# EAGLE design bulb-2 (EAGLE 6.5.0)
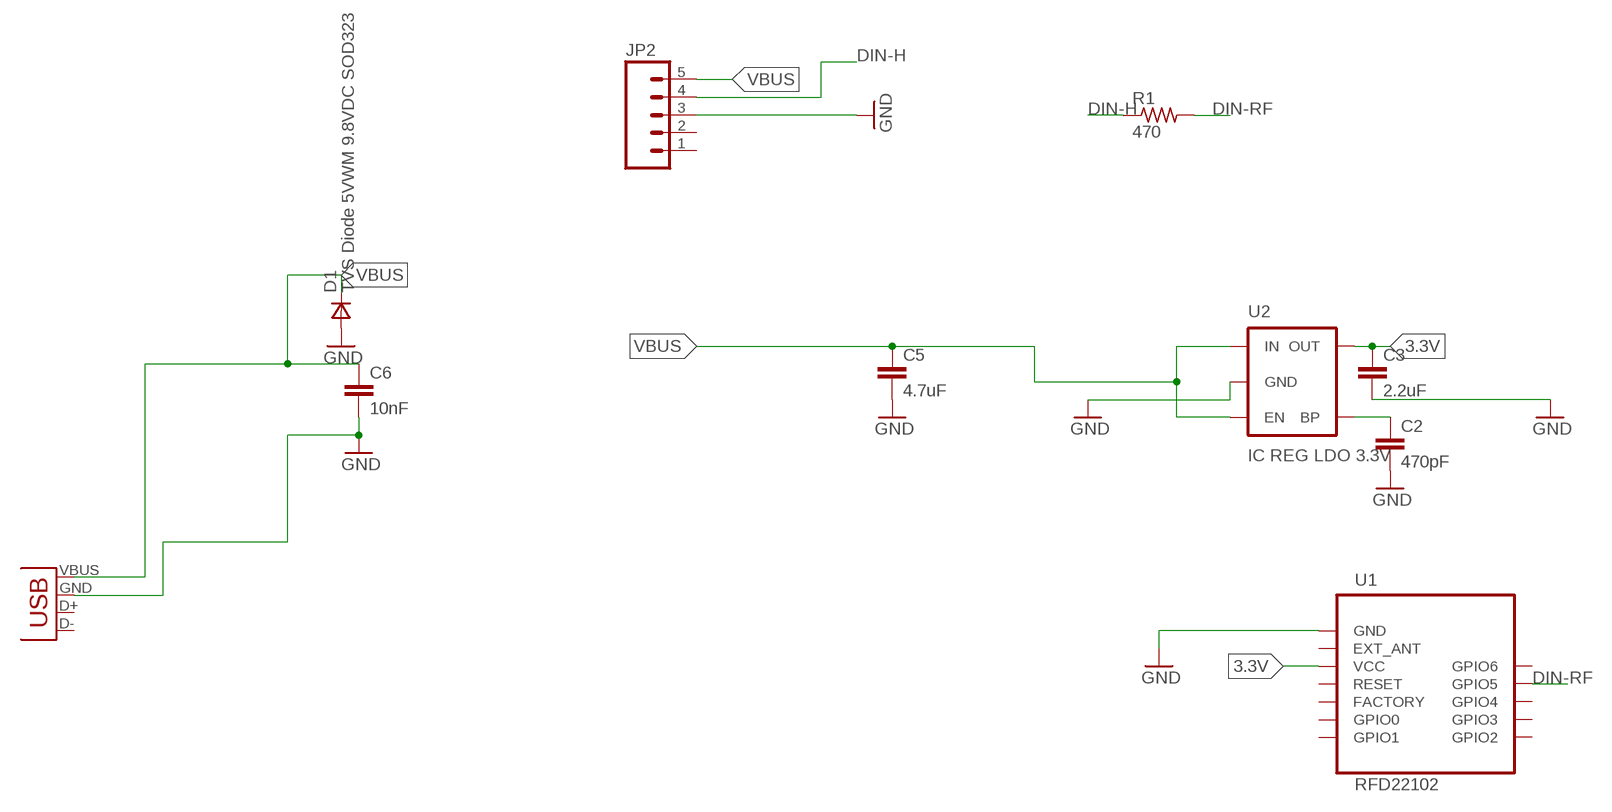
[diagram p0: schematic, sheet 1]

## Parts
C2  470pF  470PF-50V-5%(0603)SMD  [0603-CAP]
C3  2.2uF  2.2UF-10V-20%(0603)  [0603-CAP]
C5  4.7uF  4.7UF-6.3V-10%(0603)0603  [0603-CAP]
C6  10nF  10NF/10000PF-50V-10%(0603)  [0603-CAP]
D1  TVS Diode 5VWM 9.8VDC SOD323  DSOD323  [SOD323]
JP1  USB-A-H  [USB-A-H]
JP2  M05PTH  [1X05]
R1  470  R-US_R0603  [R0603]
U1  RFD22102  [RFD22102]
U2  IC REG LDO 3.3V  MIC52053.3V  [SOT23-5]

## Nets
3.3V: C3.1 U1.VCC U2.5(OUT)
DIN-H: JP2.4 R1.1
DIN-RF: R1.2 U1.GPIO5
GND: C2.2 C3.2 C5.2 C6.2 D1.2(A) JP1.GND(VBUS) JP2.3 U1.GND U2.2(GND)
N$2: C2.1 U2.4(BP)
VBUS: C5.1 C6.1 D1.1(C) JP1.VBUS(GND) JP2.5 U2.1(IN) U2.3(EN)
Unconnected: JP1.D+(D-) JP1.D-(D+) JP2.1 JP2.2 U1.EXT_ANT U1.FACTORY U1.GPIO0 U1.GPIO1 U1.GPIO2 U1.GPIO3 U1.GPIO4 U1.GPIO6 U1.RESET

## Library data of the parts
C2 = SparkFun-Capacitors:470PF-50V-5%(0603): CAP-07884; PROD_ID: CAP-07884
C3 = SparkFun-Capacitors:2.2UF-10V-20%(0603): CAP-07888; PROD_ID: CAP-07888
C5 = SparkFun-Capacitors:4.7UF-6.3V-10%(0603): CAP-08280; PROD_ID: CAP-08280
C6 = SparkFun-Capacitors:10NF/10000PF-50V-10%(0603): CAP-00867; PROD_ID: CAP-00867
D1 = zetex:D: DIODE; MPN: CDSOD323-T05C; OC_FARNELL: 1824860; OC_NEWARK: 79R6078
JP1 = SparkFun-Connectors:USB: USB Connectors USB-B-PTH is fully proven SKU : PRT-00139/CONN-08278 USB-miniB is fully proven SKU : PRT-00587 USB-A-PCB is untested. USB-A-H is throughly reviewed, but untested. Spark Fun Electronics SKU : PRT-00437 USB-B-SMT is throughly reviewed, but untested. Needs silkscreen touching up. USB-A-S has not been used/tested USB-MB-H has not been used/tested USB-MICROB has been used. CONN-09505
JP2 = SparkFun-Connectors:M05: Header 5 Standard 5-pin 0.1" header. Use with straight break away headers (SKU : PRT-00116), right angle break away headers (PRT-00553), swiss pins (PRT-00743), machine pins (PRT-00117), and female headers (PRT-00115). Molex polarized connector foot print use with SKU : PRT-08230 with associated crimp pins and housings.
R1 = resistor:R-US_: RESISTOR, American symbol
U1 = RF_Digital_RFD22102_Eagle_Schematic_PCB_Library:RFD22102: RFD22102 RFduino DIP module RFduino Datasheet: http://www.rfdigital.com/wp-content/uploads/2014/03/rfduino.datasheet.pdf
U2 = SparkFun-PowerIC:MIC5205: MIC5205 150mA vreg 3.3V - VREG-00822 5V - VREG-00823; PROD_ID: VREG-00822

## Board
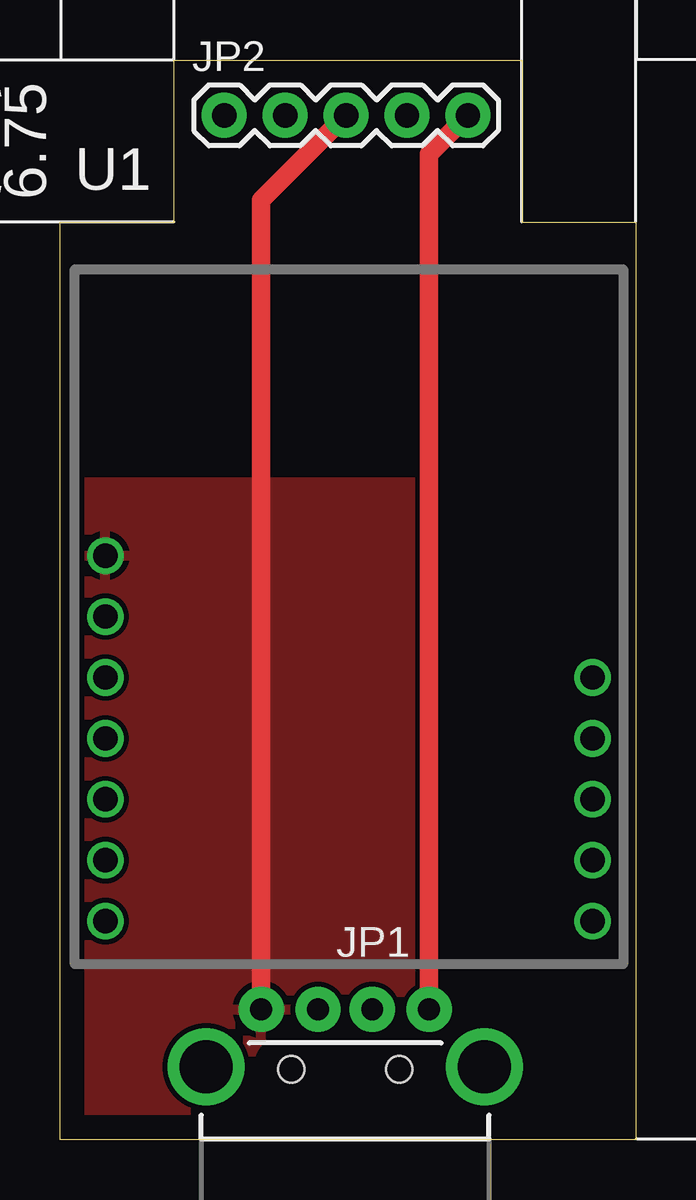
[diagram p1: board, top side]
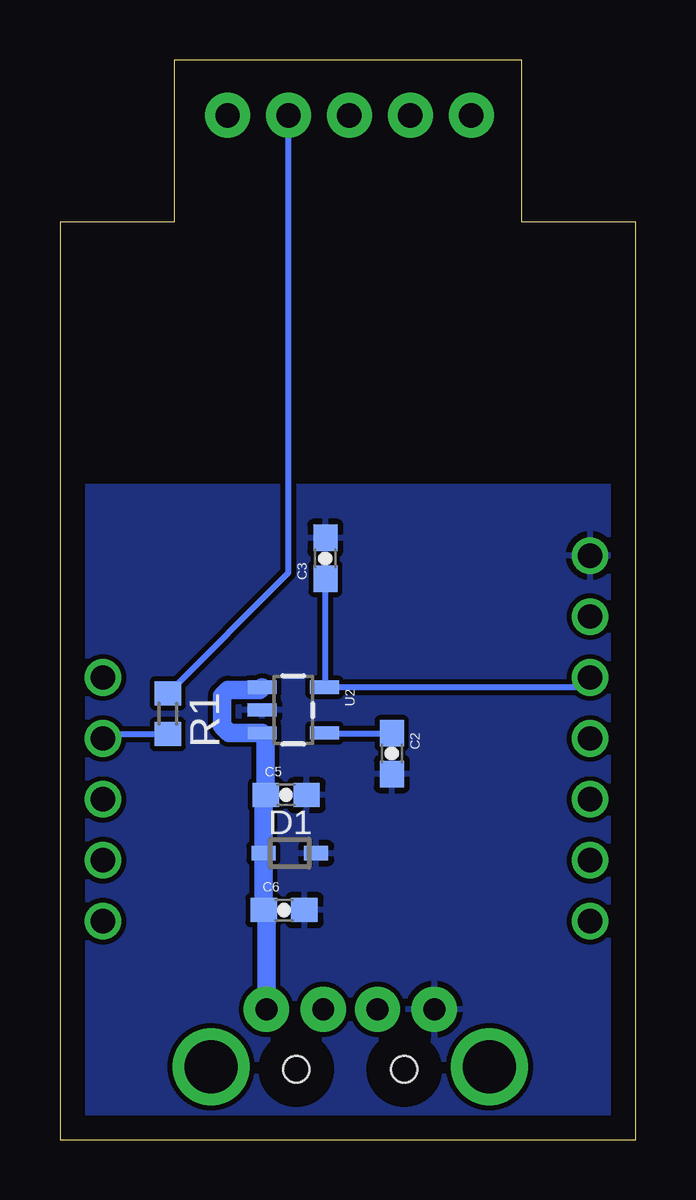
[diagram p2: board, bottom side, seen from below]

Size 24 x 45 mm. Coordinates in mm from the lower left corner, seen from the top.
Outline: 24,0 0,0 0,38.25 4.75,38.25 4.75,45 19.25,45 19.25,38.25 24,38.25 24,0
Copper layers (1*16): Top 0.035mm / dielectric 1.5mm / Bottom 0.035mm
Design rules "default *": minimum track width 10mil, minimum drill 6mil, track to track 8mil, track to pad 8mil, pad to pad 8mil, via to via 8mil, smd to smd 8mil, copper to edge 40mil, drill to drill 8mil, minimum pad ring 10mil, minimum via ring 8mil, stop-mask expansion 4mil, vias tented up to drill 0mil, thermal gap 10mil

### Footprints (pad centres in the part's own frame; a part is rotated, then mirrored left to right if it is on the bottom)
0603-CAP = smd 1.1 x 1: 1 -0.85,0; 2 0.85,0
SOD323 = smd 1 x 0.6: 1 -1.1,0; 2 1.1,0
USB-A-H = drill 0.914 pad 1.88: D+ 2.4,1.127; D- 2.4,-1.127; GND 2.4,3.5; VBUS 2.4,-3.5 | drill 2.2: GND2 0,-5.8; GND3 0,5.8 | hole 1.1: -0.1,2.25; -0.1,-2.25
1X05 = drill 1.016 pad 1.88: 1 0,0; 2 2.54,0; 3 5.08,0; 4 7.62,0; 5 10.16,0
R0603 = smd 1 x 1.1: 1 -0.85,0; 2 0.85,0
RFD22102 = drill 1.016: EXT_ANT -10.16,0; FACTORY -10.16,-7.62; GND -10.16,2.54; GPIO0 -10.16,-10.16; GPIO1 -10.16,-12.7; GPIO2 10.16,-12.7; GPIO3 10.16,-10.16; GPIO4 10.16,-7.62; GPIO5 10.16,-5.08; GPIO6 10.16,-2.54; RESET -10.16,-5.08; VCC -10.16,-2.54
SOT23-5 = smd 0.55 x 1.2: 1 -0.95,-1.3; 2 0,-1.3; 3 0.95,-1.3; 4 0.95,1.3; 5 -0.95,1.3

### Placement (x,y rotation side)
C2  10.16,16.09 270 bottom
C3  12.94,24.23 90 bottom
C5  14.57,14.36 0 bottom
C6  14.66,9.56 0 bottom
D1  14.42,11.94 0 bottom
JP1  11.89,3.03 90 top
JP2  6.85,42.69 0 top
R1  19.5,17.75 270 bottom
U1  12.05,21.8 0 top
U2  14.27,17.9 270 bottom

### Tracks (layer width: path | path; a pad name or v marks a point on that pad's centre or on a via)
3.3V
  Bottom 0.254: U1.VCC 2.3,18.85 U2.5 12.94,18.89 C3.1
DIN-H
  Bottom 0.254: R1.1 14.47,23.63 JP2.4
DIN-RF
  Bottom 0.254: U1.GPIO5 22.03,16.9 R1.2
GND
  Top 0.762: JP2.3 8.39,39.16 JP1.GND
  pour Top: -5.05,-5.5 -7.95,-5.5 -8.65,27.4 51.45,27.4 52.15,-5.9
  pour Bottom: -9.45,-6.8 -16.95,-6.8 -17.65,27.2 97.85,27.2 98.55,67.6 101.05,67.6 101.05,-6.1
N$2
  Bottom 0.254: U2.4 12.95,16.94 C2.1
VBUS
  Top 0.762: JP2.5 15.39,41.08 JP1.VBUS
  Bottom 0.762: JP1.VBUS 15.39,9.45 C6.1 15.51,11.93 D1.1 15.52,14.26 C5.1 15.42,16.8 U2.3 16.95,16.95 17.25,17.25 17.25,18.5 17,18.75 15.67,18.75 U2.1